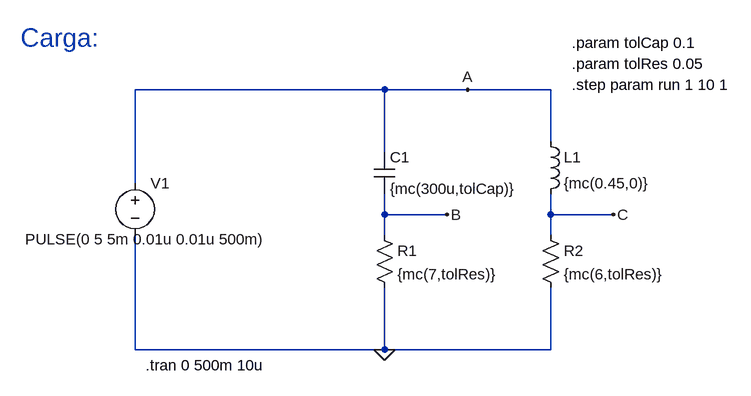
[diagram p0: schematic Etapa_Carga - MC.asc]
Etapa_Carga - MC.asc, the LTspice schematic file:
Version 4
SHEET 1 880 680
WIRE 32 -80 -352 -80
WIRE 160 -80 32 -80
WIRE 288 -80 160 -80
WIRE 288 0 288 -80
WIRE 32 16 32 -80
WIRE -352 64 -352 -80
WIRE 32 112 32 80
WIRE 128 112 32 112
WIRE 288 112 288 80
WIRE 384 112 288 112
WIRE 32 144 32 112
WIRE 288 144 288 112
WIRE -352 320 -352 144
WIRE 32 320 32 224
WIRE 32 320 -352 320
WIRE 288 320 288 224
WIRE 288 320 32 320
FLAG 32 320 0
FLAG 160 -80 A
FLAG 128 112 B
FLAG 384 112 C
SYMBOL res 16 128 R0
SYMATTR InstName R1
SYMATTR Value {mc(7,tolRes)}
SYMBOL res 272 128 R0
SYMATTR InstName R2
SYMATTR Value {mc(6,tolRes)}
SYMBOL cap 16 16 R0
SYMATTR InstName C1
SYMATTR Value {mc(300u,tolCap)}
SYMBOL ind 272 -16 R0
SYMATTR InstName L1
SYMATTR Value {mc(0.45,0)}
SYMBOL voltage -352 48 R0
WINDOW 3 -169 102 Left 2
WINDOW 123 0 0 Left 0
WINDOW 39 0 0 Left 0
SYMATTR Value PULSE(0 5 5m 0.01u 0.01u 500m)
SYMATTR InstName V1
TEXT -336 344 Left 2 !.tran 0 500m 10u
TEXT -528 -160 Left 4 ;Carga:
TEXT 320 -152 Left 2 !.param tolCap 0.1
TEXT 320 -120 Left 2 !.param tolRes 0.05
TEXT 320 -88 Left 2 !.step param run 1 10 1

The netlist it stands for:
* Etapa_Carga - MC.asc
R1 B 0 {mc(7,tolRes)}
R2 C 0 {mc(6,tolRes)}
C1 A B {mc(300u,tolCap)}
L1 A C {mc(0.45,0)}
V1 A 0 PULSE(0 5 5m 0.01u 0.01u 500m)
.tran 0 500m 10u
* Carga:
.param tolCap 0.1
.param tolRes 0.05
.step param run 1 10 1
.backanno
.end